# Altium project _X-Link-v9.x.PrjPCB
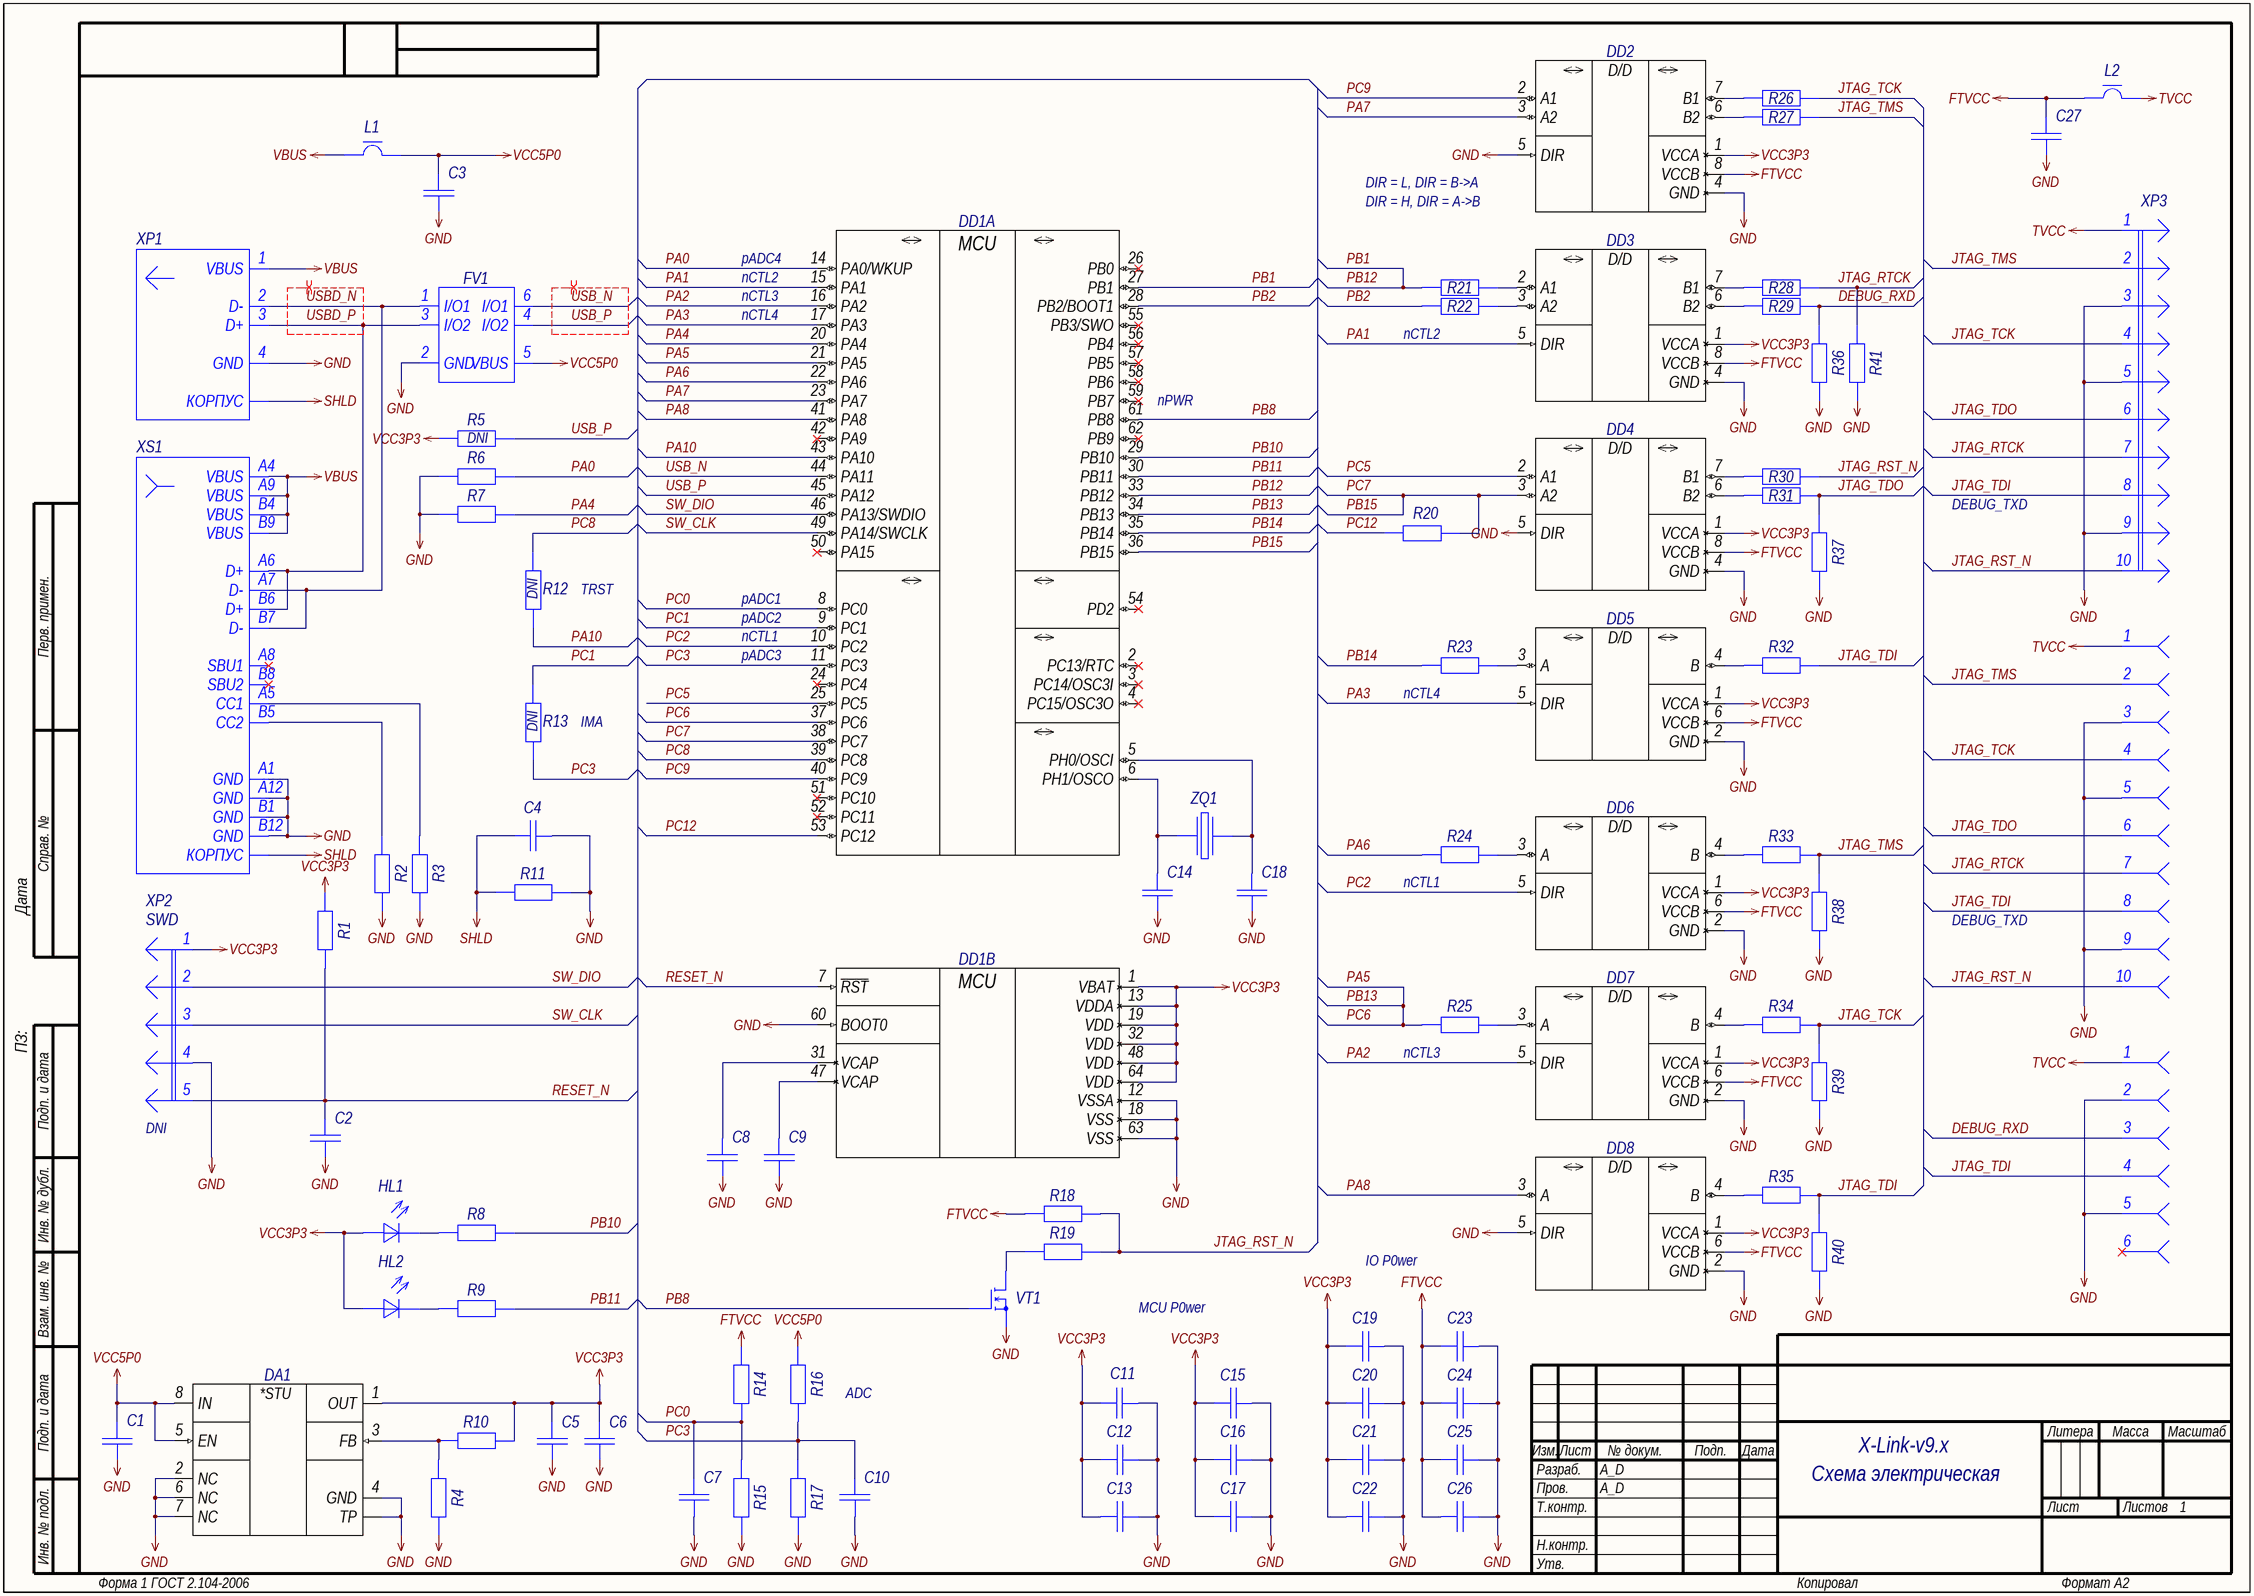
[diagram p0: 01_MAIN.SchDoc]
GlobalOrganizationName: A_D Electronics; GlobalProjectName: X-Link-v9.x; GlobalProjectNumber: A_D.000000.001; GlobalProjectRevision: 0; PCB_Week: 2012
1 sheet, 90 parts. Net scope: hierarchical (ports join the sheet entries above them; power ports are global).
Board file: BOARD.PcbDoc

## Sheet 01_MAIN.SchDoc: =GlobalProjectName
size 594 x 420 mm; CheckedBy: A_D; Author: A_D; Organization: A_D Electronics; DocumentNumber: A_D.000000.001 Э3; Revision: 0; SheetTotal: 1; PageSetup: Record=PageOptions|CenterHorizontal=True|CenterVertical=True|PrintScale=0.70|XCorrection=1.00|YCorrection=1.00|PrintKind=2|BorderSize=5000000|LeftOffset=9000|BottomOffset=10100|Orientation=2|PaperLength=11176|PaperWidth=8636|Scale=100|PaperSource=259|PrintQuality=-3|MediaType=1|DitherType=10|PrintScaleMode=1|PaperKind=A3|PaperIndex=8; FirstApplication: A_D.000000.001; DocumentName: X-Link-v9.x

### Parts
C1  Capacitor  [C0402_L]  (value not drawn)
C2  (no value)  [C0402_L]
C3  Capacitor  [C0603_L]  (value not drawn)
C4  (no value)  [C0402_L]
C5  Capacitor  [C0402_L]  (value not drawn)
C6  Capacitor  [C0402_L]  (value not drawn)
C7  Capacitor  [C0402_L]  (value not drawn)
C8  Capacitor  [C0402_L]  (value not drawn)
C9  Capacitor  [C0402_L]  (value not drawn)
C10  Capacitor  [C0402_L]  (value not drawn)
C11  Capacitor  [C0402_L]  (value not drawn)
C12  (no value)  [C0402_L]
C13  (no value)  [C0402_L]
C14  Capacitor  [C0402_L]  (value not drawn)
C15  (no value)  [C0402_L]
C16  (no value)  [C0402_L]
C17  (no value)  [C0402_L]
C18  Capacitor  [C0402_L]  (value not drawn)
C19  (no value)  [C0402_L]
C20  (no value)  [C0402_L]
C21  (no value)  [C0402_L]
C22  (no value)  [C0402_L]
C23  (no value)  [C0402_L]
C24  (no value)  [C0402_L]
C25  (no value)  [C0402_L]
C26  (no value)  [C0402_L]
C27  Capacitor  [C0402_L]  (value not drawn)
DA1  TPS73701DRB  [VSON-8_065P300X300X100_N]  (value not drawn)
DD1  STM32F205RxTx-Series  [LQFP-64_050P1000X1000X160_N]  (value not drawn)  (parts A,B of 2)
DD2  SN74LVC2T45DCx-Series  [VSSOP-8_050P200X230X090_N]  (value not drawn)
DD3  SN74LVC2T45DCx-Series  [VSSOP-8_050P200X230X090_N]  (value not drawn)
DD4  SN74LVC2T45DCx-Series  [VSSOP-8_050P200X230X090_N]  (value not drawn)
DD5  74LVC1T45x-Series  [X2-DFN-6_050P140X100X040_N]  (value not drawn)
DD6  74LVC1T45x-Series  [X2-DFN-6_050P140X100X040_N]  (value not drawn)
DD7  74LVC1T45x-Series  [X2-DFN-6_050P140X100X040_N]  (value not drawn)
DD8  74LVC1T45x-Series  [X2-DFN-6_050P140X100X040_N]  (value not drawn)
FV1  USBLC6-2x6  [SOT-666_050P160X120X060_N]  (value not drawn)
HL1  Text  [LD0402]  (value not drawn)
HL2  Text  [LD0402]  (value not drawn)
L1  FerriteBead  [L0402_L]  (value not drawn)
L2  FerriteBead  [L0402_L]  (value not drawn)
R1  Resistor  [R0402_L]  (value not drawn)
R2  Resistor  [R0402_L]  (value not drawn)
R3  Resistor  [R0402_L]  (value not drawn)
R4  Resistor  [R0402_L]  (value not drawn)
R5  Resistor  [R0402_L]  (value not drawn)  (no BOM)
R6  Resistor  [R0402_L]  (value not drawn)
R7  Resistor  [R0402_L]  (value not drawn)
R8  Resistor  [R0402_L]  (value not drawn)
R9  Resistor  [R0402_L]  (value not drawn)
R10  Resistor  [R0402_L]  (value not drawn)
R11  (no value)  [R0402_L]
R12  Resistor  [R0402_L]  (value not drawn)  (no BOM)
R13  Resistor  [R0402_L]  (value not drawn)  (no BOM)
R14  Resistor  [R0402_L]  (value not drawn)
R15  Resistor  [R0402_L]  (value not drawn)
R16  Resistor  [R0402_L]  (value not drawn)
R17  Resistor  [R0402_L]  (value not drawn)
R18  Resistor  [R0402_L]  (value not drawn)
R19  Resistor  [R0402_L]  (value not drawn)
R20  Resistor  [R0402_L]  (value not drawn)
R21  Resistor  [R0402_L]  (value not drawn)
R22  Resistor  [R0402_L]  (value not drawn)
R23  Resistor  [R0402_L]  (value not drawn)
R24  Resistor  [R0402_L]  (value not drawn)
R25  Resistor  [R0402_L]  (value not drawn)
R26  Resistor  [R0402_L]  (value not drawn)
R27  Resistor  [R0402_L]  (value not drawn)
R28  Resistor  [R0402_L]  (value not drawn)
R29  Resistor  [R0402_L]  (value not drawn)
R30  Resistor  [R0402_L]  (value not drawn)
R31  Resistor  [R0402_L]  (value not drawn)
R32  Resistor  [R0402_L]  (value not drawn)
R33  Resistor  [R0402_L]  (value not drawn)
R34  Resistor  [R0402_L]  (value not drawn)
R35  Resistor  [R0402_L]  (value not drawn)
R36  Resistor  [R0402_L]  (value not drawn)
R37  Resistor  [R0402_L]  (value not drawn)
R38  Resistor  [R0402_L]  (value not drawn)
R39  Resistor  [R0402_L]  (value not drawn)
R40  Resistor  [R0402_L]  (value not drawn)
R41  Resistor  [R0402_L]  (value not drawn)
VT1  MOSFET-N  [SOT-883B_035P060X100X040_N]  (value not drawn)
XP1  Text  [DS1097]  (value not drawn)
XP2  SWD  [PLS-5]  (no BOM)
XP3  JTAG  [IDC-10MR]  (value not drawn)
XS1  Text  [U262-161N-4BVC11]  (value not drawn)
XS2  JTAG-FFC  [XF2M-1015-1A]  (value not drawn)  (parts A,B,C,D,E,F,G,H,I,J of 10)
XS3  SWO  [XF2M-0615-1A]  (value not drawn)  (parts A,B,C,D,E,F of 6)
ZQ1  Crystal  [SMD 5x3.2mm]  (value not drawn)

### Nets
FTVCC: C23.1 C24.1 C25.1 C26.1 C27.2 DD2.8(VCCB) DD3.8(VCCB) DD4.8(VCCB) DD5.6(VCCB) DD6.6(VCCB) DD7.6(VCCB) DD8.6(VCCB) L2.1 R14.2 R18.1
GND: C1.1 C2.2 C3.1 C4.1 C5.1 C6.1 C7.2 C8.1 C9.1 C10.2 C11.1 C12.2 C13.2 C14.1 C15.2 C16.2 C17.2 C18.1 C19.2 C20.2 C21.2 C22.2 C23.2 C24.2 C25.2 C26.2 C27.1 DA1.2(NC) DA1.4(GND) DA1.6(NC) DA1.7(NC) DA1.TP DD1.12(VSSA) DD1.18(VSS) DD1.60(BOOT0) DD1.63(VSS) DD2.4(GND) DD2.5(DIR) DD3.4(GND) DD4.4(GND) DD4.5(DIR) DD5.2(GND) DD6.2(GND) DD7.2(GND) DD8.2(GND) DD8.5(DIR) FV1.2(GND) R2.1 R3.1 R4.1 R6.1 R7.1 R11.2 R15.1 R17.1 R36.1 R37.1 R38.1 R39.1 R40.1 R41.1 VT1.3(S) XP1.4(GND) XP2.4 XP3.3 XP3.5 XP3.9 XS1.A1(GND) XS1.A12(GND) XS1.B1(GND) XS1.B12(GND) XS2.3 XS2.5 XS2.9 XS3.2 XS3.5
SHLD: C4.2 R11.1 XP1.SH(КОРПУС) XS1.SH(КОРПУС)
TVCC: L2.2 XP3.1 XS2.1 XS3.1
VBUS: L1.1 XP1.1(VBUS) XS1.A4(VBUS) XS1.A9(VBUS) XS1.B4(VBUS) XS1.B9(VBUS)
VCC3P3: C5.2 C6.2 C11.2 C12.1 C13.1 C15.1 C16.1 C17.1 C19.1 C20.1 C21.1 C22.1 DA1.1(OUT) DD1.1(VBAT) DD1.13(VDDA) DD1.19(VDD) DD1.32(VDD) DD1.48(VDD) DD1.64(VDD) DD2.1(VCCA) DD3.1(VCCA) DD4.1(VCCA) DD5.1(VCCA) DD6.1(VCCA) DD7.1(VCCA) DD8.1(VCCA) HL1.1(А) HL2.1(А) R1.2 R5.1 R10.2 XP2.1
VCC5P0: C1.2 C3.2 DA1.5(EN) DA1.8(IN) FV1.5(VBUS) L1.2 R16.2
DEBUG_RXD: R29.2 R36.2 XS3.3
JTAG_RST_N: R18.2 R19.2 R30.2 XP3.10 XS2.10
JTAG_RTCK: R28.2 R41.2 XP3.7 XS2.7
JTAG_TCK: R26.2 R34.2 R39.2 XP3.4 XS2.4
JTAG_TDI: R32.2 R35.2 R40.2 XP3.8 XS2.8 XS3.4
JTAG_TDO: R31.2 R37.2 XP3.6 XS2.6
JTAG_TMS: R27.2 R33.2 R38.2 XP3.2 XS2.2
PA0: DD1.14(PA0/WKUP) R6.2
PA1: DD1.15(PA1) DD3.5(DIR)
PA2: DD1.16(PA2) DD7.5(DIR)
PA3: DD1.17(PA3) DD5.5(DIR)
PA4: DD1.20(PA4) R7.2
PA5: DD1.21(PA5) DD1.34(PB13) DD1.37(PC6) R25.1  [also labelled PB13, PC6]
PA6: DD1.22(PA6) R24.1
PA7: DD1.23(PA7) DD2.3(A2)
PA8: DD1.41(PA8) DD8.3(A)
PA10: DD1.43(PA10) R12.1
PB1: DD1.27(PB1) DD1.33(PB12) R21.1  [also labelled PB12]
PB2: DD1.28(PB2/BOOT1) R22.1
PB8: DD1.61(PB8) VT1.1(G)
PB10: DD1.29(PB10) R8.2
PB11: DD1.30(PB11) R9.2
PB14: DD1.35(PB14) R23.1
PB15: DD1.36(PB15) DD1.38(PC7) DD4.3(A2) R20.2  [also labelled PC7]
PC0: C7.1 DD1.8(PC0) R14.1 R15.2
PC1: DD1.9(PC1) R13.2
PC2: DD1.10(PC2) DD6.5(DIR)
PC3: C10.1 DD1.11(PC3) R13.1 R16.1 R17.2
PC5: DD1.25(PC5) DD4.2(A1)
PC8: DD1.39(PC8) R12.2
PC9: DD1.40(PC9) DD2.2(A1)
PC12: DD1.53(PC12) R20.1
RESET_N: C2.1 DD1.7(~{RST}) R1.1 XP2.5
SW_CLK: DD1.49(PA14/SWCLK) XP2.3
SW_DIO: DD1.46(PA13/SWDIO) XP2.2
USB_N: DD1.44(PA11) FV1.6(I/O1)
USB_P: DD1.45(PA12) FV1.4(I/O2) R5.2
USBD_N: FV1.1(I/O1) XP1.2(D-) XS1.A7(D-) XS1.B7(D-)
USBD_P: FV1.3(I/O2) XP1.3(D+) XS1.A6(D+) XS1.B6(D+)
NetC8_2: C8.2 DD1.31(VCAP)
NetC9_2: C9.2 DD1.47(VCAP)
NetC14_2: C14.2 DD1.6(PH1/OSCO) ZQ1.1
NetC18_2: C18.2 DD1.5(PH0/OSCI) ZQ1.3
NetDA1_3: DA1.3(FB) R4.2 R10.1
NetDD2_6: DD2.6(B2) R27.1
NetDD2_7: DD2.7(B1) R26.1
NetDD3_2: DD3.2(A1) R21.2
NetDD3_3: DD3.3(A2) R22.2
NetDD3_6: DD3.6(B2) R29.1
NetDD3_7: DD3.7(B1) R28.1
NetDD4_6: DD4.6(B2) R31.1
NetDD4_7: DD4.7(B1) R30.1
NetDD5_3: DD5.3(A) R23.2
NetDD5_4: DD5.4(B) R32.1
NetDD6_3: DD6.3(A) R24.2
NetDD6_4: DD6.4(B) R33.1
NetDD7_3: DD7.3(A) R25.2
NetDD7_4: DD7.4(B) R34.1
NetDD8_4: DD8.4(B) R35.1
NetHL1_2: HL1.2(К) R8.1
NetHL2_2: HL2.2(К) R9.1
NetR2_2: R2.2 XS1.B5(CC2)
NetR3_2: R3.2 XS1.A5(CC1)
NetR19_1: R19.1 VT1.2(D)

Not connected (* = marked no-connect by the designer): DD1 2(PC13/RTC)* 3(PC14/OSC3I)* 4(PC15/OSC3O)* 24(PC4)* 26(PB0)* 42(PA9)* 50(PA15)* 51(PC10)* 52(PC11)* 54(PD2)* 55(PB3/SWO)* 56(PB4)* 57(PB5)* 58(PB6)* 59(PB7)* 62(PB9)*; XS1 A8(SBU1)* B8(SBU2)*; XS3 6*

### Layout directives
differential pair; differential pair class USBD: USBD_N, USBD_P
differential pair; differential pair class USB: USB_N, USB_P

### Notes on the sheet
- (near DD2) DIR = L, DIR = B->A
- (near DD2) DIR = H, DIR = A->B
- pADC4
- nCTL3
- nCTL2
- nCTL4
- (near R22) nCTL2
- (near DD1) nPWR
- (near R5) DNI
- DEBUG_TXD
- (near R12) DNI
- TRST
- nCTL1
- pADC1
- pADC2
- pADC3
- (near R23) nCTL4
- (near R13) DNI
- IMA
- (near R24) nCTL1
- (near R25) nCTL3
- (near XP2) DNI
- IO P0wer
- MCU P0wer
- ADC
- Схема электрическая
  принципиальная
- Перв. примен.
- Справ. №
- ПЗ:                             Дата
- Подп. и дата
- Инв. № дубл.
- Взам. инв. №
- Разраб.
- Изм.
- Лист
- № докум.
- Подп.
- Дата
- Литера
- Масса
- Масштаб
- Пров.
- Т.контр.
- Листов
- Инв. № подл.
- Н.контр.
- Утв.
- Форма 1 ГОСТ 2.104-2006
- Копировал
- Формат А2
- (in symbol 74LVC1T45FZ4-7) D/D
- (in symbol SN74LVC2T45DCUR) D/D
- (in symbol STM32F205RET6, part A) MCU
- (in symbol STM32F205RET6, part B) MCU
- (in symbol TPS73701DRBR) *STU

### Library data of the parts
C1 = GRM155R61C105KA12D: Manufacturer: Murata; Type: Конденсатор; ID: 272; Value: 1uF; Voltage: 16V; Tolerance: ±10%; Dielectric Type: X5R; Application Category: 1; Working Temperature Min: -55°С; Working Temperature Max: +85°С; Published: 18.05.2010; Publisher: Andrew Danich; Part Number: GRM155R61C105KA12D; Footprint: 0402; ClassName: DirectConnect
C2 C4 C12 C13 C15-C17 C19-C26 = GCM155R71C104KA55D: Manufacturer: Murata; Type: Конденсатор; ID: 163; Value: 0.1uF; Voltage: 16V; Tolerance: ±10%; Dielectric Type: X7R; Application Category: 1; Working Temperature Min: -55°С; Working Temperature Max: +125°С; Functional Analog: GRM155R71C104KA88D; Published: 18.05.2010; Publisher: Andrew Danich; Part Number: GCM155R71C104KA55D; Footprint: 0402
  C4 C12 C13 C15-C17 C19-C26: ClassName: DirectConnect
C3 = GRM188R61A106KE69D: Manufacturer: Murata; Type: Конденсатор; ID: 173; Value: 10uF; Voltage: 10V; Tolerance: ±10%; Dielectric Type: X5R; Application Category: 1; Working Temperature Min: -55°С; Working Temperature Max: +85°С; Published: 18.05.2010; Publisher: Andrew Danich; Part Number: GRM188R61A106KE69D; Footprint: 0603; ClassName: DirectConnect
C5 C6 C11 = GRM155R60J475ME87D: Manufacturer: Murata; Type: Конденсатор; ID: 223; Value: 4.7uF; Voltage: 6.3V; Tolerance: ±20%; Dielectric Type: X5R; Application Category: 1; Working Temperature Min: -55°С; Working Temperature Max: +85°С; Published: 18.05.2010; Publisher: Andrew Danich; Part Number: GRM155R60J475ME87D; Footprint: 0402; ClassName: DirectConnect
C7 C10 = GCM155R71E103KA37D: Manufacturer: Murata; Type: Конденсатор; ID: 150; Value: 0.01uF; Voltage: 25V; Tolerance: ±10%; Dielectric Type: X7R; Application Category: 1; Working Temperature Min: -55°С; Working Temperature Max: +125°С; Functional Analog: GRM155R71E103KA01D; Published: 18.05.2010; Publisher: Andrew Danich; Part Number: GCM155R71E103KA37D; Footprint: 0402
C8 C9 C27 = GRM155D71C225ME11D: Manufacturer: Murata; Type: Конденсатор; ID: 180; Value: 2.2uF; Voltage: 16V; Tolerance: ±20%; Dielectric Type: X7T; Application Category: 1; Working Temperature Min: -55°С; Working Temperature Max: +125°С; Functional Analog: GRM155R60J225ME15D; Published: 18.05.2010; Publisher: Andrew Danich; Part Number: GRM155D71C225ME11D; Footprint: 0402; ClassName: DirectConnect
C14 C18 = GRM1555C1H120JA01D: Manufacturer: Murata; Type: Конденсатор; ID: 159; Value: 12pF; Voltage: 50V; Tolerance: ±5%; Dielectric Type: NP0; Application Category: 1; Published: 18.05.2010; Publisher: Andrew Danich; Part Number: GRM1555C1H120JA01D; Footprint: 0402; ClassName: DirectConnect
DA1 = TPS73701DRBR: Manufacturer: Texas Instruments; ID: 26; Input Voltage: +2.2…5.5V; Output Current: 1A; Output Voltage: +1.2…5.5V; Application Category: 1; Working Temperature Min: -40°С; Working Temperature Max: +125°С; Functional Analog: TPS73701DRBT; Published: 25.03.2019; Publisher: Andrew Danich; Type: Микросхема; Part Number: TPS73701DRBR; Value: TPS73701DRBR; ClassName: DirectConnect
DD1 = STM32F205RET6: Manufacturer: STMicroelectronics; ID: 33; Supply Operation: +1.8…3.6V; Flash: 512K; SRAM: 128K; Prog Interface: JTAG, SWD, UART; I/O Lines: 51; Operation Frequency: 120MHz; Application Category: 1; Working Temperature Min: -40°С; Working Temperature Max: +85°С; Published: 16.10.2015; Publisher: Andrew Danich; Type: Микросхема; Part Number: STM32F205RET6; Value: STM32F205RET6; EEPROM: -
DD2-DD4 = SN74LVC2T45DCUR: Manufacturer: Texas Instruments; ID: 18; Supply 1 Operation: +1,65…5,5V; Supply Current: 10uA; Directional: Unidirection; Channels: 2; Max Data Rate: 420Mbps; Application Category: 1; Working Temperature Min: -40°С; Working Temperature Max: +85°С; Functional Analog: 74LVCH2T45DC,125; Published: 06.03.2020; Publisher: Andrew Danich; Type: Микросхема; Part Number: SN74LVC2T45DCUR; Value: SN74LVC2T45DCUR; Supply 2 Operation: +1,65…5,5V
DD5-DD8 = 74LVC1T45FZ4-7: Manufacturer: Diodes Incorporated; ID: 13; Supply 1 Operation: +1.65…5.5V; Supply Current: 3uA; Directional: Bidirection; Channels: 1; Prop Delay: 15.1nS; Working Temperature Min: -40°С; Working Temperature Max: +150°С; Published: 17.07.2019; Publisher: Andrew Danich; Type: Микросхема; Part Number: 74LVC1T45FZ4-7; Value: 74LVC1T45FZ4-7; Supply 2 Operation: +1.65…5.5V; Application Category: 1
FV1 = USBLC6-2P6: Manufacturer: STMicroelectronics; ID: 30; Breakdown Voltage: 6V; Reverse Stand Off Voltage: 17V; Forward Voltage: 0.95V; Peak Forward Current: 5A; Junction Capacitance: 2.5pF; Directional: Bidirectional; Application Category: 1; Working Temperature Min: -40°С; Working Temperature Max: +125°С; Published: 21.02.2017; Publisher: Andrew Danich; Type: Супрессор; Part Number: USBLC6-2P6; Value: USBLC6-2P6; Functional Analog: -; ClassName: DirectConnect
HL1 HL2 = KPHHS-1005QBC-D-V: Manufacturer: Kingbright; Type: Индикатор единичный; ID: 24; Forward Voltage: 3.3V; Forward Current: 20mA; Power Dissipation: 120mW; Luminous Flux: 60; Color: Blue; Leds: 1; Working Temperature Min: -40°С; Working Temperature Max: +85°С; Published: 03.12.2013; Publisher: Andrew Danich; Part Number: KPHHS-1005QBC-D-V; Value: KPHHS-1005QBC-D-V; Footprint: 0402; Application Category: 1
L1 L2 = BLM15PD121SN1D: Manufacturer: Murata; Type: Дроссель; ID: 11; Rated Current: 1.3A; Impedance at 100Mhz: 120ohm; Tolerance: ±25%; DC Resistance: 0.09ohm; Inductor Type: EMIFIL; Application Category: 1; Working Temperature Min: -55°С; Working Temperature Max: +125°С; Published: 14.11.2014; Publisher: Andrew Danich; Part Number: BLM15PD121SN1D; Value: BLM15PD121SN1D; Footprint: 0402; ClassName: DirectConnect
R1 = RC0402JR-0710KL: Manufacturer: Yageo; ID: 476; Value: 10k; Limit Voltage: 50V; Tolerance: ±5%; Temperature Coefficient: 100ppm; Total Power Dissipation: 0.1W; Series Type: Thick-Film; Application Category: 1; Working Temperature Min: -55°С; Working Temperature Max: +155°С; Published: 24.03.2010; Publisher: Andrew Danich; Type: Резистор; Part Number: RC0402JR-0710KL; Footprint: 0402
R2 R3 = RC0402FR-075K1L: Manufacturer: Yageo; ID: 496; Value: 5.1k; Limit Voltage: 50V; Tolerance: ±1%; Temperature Coefficient: 100ppm; Total Power Dissipation: 0.1W; Series Type: Thick-Film; Application Category: 1; Working Temperature Min: -55°С; Working Temperature Max: +155°С; Published: 24.03.2010; Publisher: Andrew Danich; Type: Резистор; Part Number: RC0402FR-075K1L; Footprint: 0402
R4 = RC0402FR-0712KL: Manufacturer: Yageo; ID: 318; Value: 12k; Limit Voltage: 50V; Tolerance: ±1%; Temperature Coefficient: 100ppm; Total Power Dissipation: 0.1W; Series Type: Thick-Film; Application Category: 1; Working Temperature Min: -55°С; Working Temperature Max: +155°С; Published: 24.03.2010; Publisher: Andrew Danich; Type: Резистор; Part Number: RC0402FR-0712KL; Footprint: 0402
R5 = RC0402FR-071K6L: Manufacturer: Yageo; ID: 504; Value: 1.6k; Limit Voltage: 50V; Tolerance: ±1%; Temperature Coefficient: 100ppm; Total Power Dissipation: 0.1W; Series Type: Thick-Film; Application Category: 1; Working Temperature Min: -55°С; Working Temperature Max: +155°С; Published: 24.03.2010; Publisher: Andrew Danich; Type: Резистор; Part Number: RC0402FR-071K6L; Footprint: 0402
R6 R7 R12 R13 R20 = RC0402JR-070RL: Manufacturer: Yageo; ID: 362; Value: 0; Limit Voltage: 50V; Tolerance: ±5%; Temperature Coefficient: 100ppm; Total Power Dissipation: 0.1W; Series Type: Thick-Film; Application Category: 1; Working Temperature Min: -55°С; Working Temperature Max: +155°С; Published: 24.03.2010; Publisher: Andrew Danich; Type: Резистор; Part Number: RC0402JR-070RL; Footprint: 0402
R8 R9 = RC0402JR-071KL: Manufacturer: Yageo; ID: 3; Value: 1k; Limit Voltage: 50V; Tolerance: ±5%; Temperature Coefficient: 100ppm; Total Power Dissipation: 0.1W; Series Type: Thick-Film; Application Category: 1; Working Temperature Min: -55°С; Working Temperature Max: +155°С; Published: 24.03.2010; Publisher: Andrew Danich; Type: Резистор; Part Number: RC0402JR-071KL; Footprint: 0402
R10 = RC0402FR-0722K1L: Manufacturer: Yageo; ID: 447; Value: 22.1k; Limit Voltage: 50V; Tolerance: ±1%; Temperature Coefficient: 100ppm; Total Power Dissipation: 0.1W; Series Type: Thick-Film; Application Category: 1; Working Temperature Min: -55°С; Working Temperature Max: +155°С; Published: 24.03.2010; Publisher: Andrew Danich; Type: Резистор; Part Number: RC0402FR-0722K1L; Footprint: 0402
R11 = RC0402JR-07100KL: Manufacturer: Yageo; ID: 351; Value: 100k; Limit Voltage: 50V; Tolerance: ±5%; Temperature Coefficient: 100ppm; Total Power Dissipation: 0.1W; Series Type: Thick-Film; Application Category: 1; Working Temperature Min: -55°С; Working Temperature Max: +155°С; Published: 24.03.2010; Publisher: Andrew Danich; Type: Резистор; Part Number: RC0402JR-07100KL; Footprint: 0402; ClassName: DirectConnect
R14-R17 = RC0402FR-0710KL: Manufacturer: Yageo; ID: 2; Value: 10k; Limit Voltage: 50V; Tolerance: ±1%; Temperature Coefficient: 100ppm; Total Power Dissipation: 0.1W; Series Type: Thick-Film; Application Category: 1; Working Temperature Min: -55°С; Working Temperature Max: +155°С; Published: 24.03.2010; Publisher: Andrew Danich; Type: Резистор; Part Number: RC0402FR-0710KL; Footprint: 0402
R18 = RC0402JR-074K7L: Manufacturer: Yageo; ID: 4; Value: 4.7k; Limit Voltage: 50V; Tolerance: ±5%; Temperature Coefficient: 100ppm; Total Power Dissipation: 0.1W; Series Type: Thick-Film; Application Category: 1; Working Temperature Min: -55°С; Working Temperature Max: +155°С; Published: 24.03.2010; Publisher: Andrew Danich; Type: Резистор; Part Number: RC0402JR-074K7L; Footprint: 0402
R19 = RC0402JR-0751RL: Manufacturer: Yageo; ID: 374; Value: 51; Limit Voltage: 50V; Tolerance: ±5%; Temperature Coefficient: 100ppm; Total Power Dissipation: 0.1W; Series Type: Thick-Film; Application Category: 1; Working Temperature Min: -55°С; Working Temperature Max: +155°С; Published: 24.03.2010; Publisher: Andrew Danich; Type: Резистор; Part Number: RC0402JR-0751RL; Footprint: 0402
R21-R27 R30 R31 R35 = RC0402JR-07430RL: Manufacturer: Yageo; ID: 376; Value: 430; Limit Voltage: 50V; Tolerance: ±5%; Temperature Coefficient: 100ppm; Total Power Dissipation: 0.1W; Series Type: Thick-Film; Application Category: 1; Working Temperature Min: -55°С; Working Temperature Max: +155°С; Published: 24.03.2010; Publisher: Andrew Danich; Type: Резистор; Part Number: RC0402JR-07430RL; Footprint: 0402
R28 R29 R32-R34 = RC0402JR-07100RL: Manufacturer: Yageo; ID: 479; Value: 100; Limit Voltage: 50V; Tolerance: ±5%; Temperature Coefficient: 100ppm; Total Power Dissipation: 0.1W; Series Type: Thick-Film; Application Category: 1; Working Temperature Min: -55°С; Working Temperature Max: +155°С; Published: 24.03.2010; Publisher: Andrew Danich; Type: Резистор; Part Number: RC0402JR-07100RL; Footprint: 0402
R36-R41 = RC0402JR-07200KL: Manufacturer: Yageo; ID: 353; Value: 200k; Limit Voltage: 50V; Tolerance: ±5%; Temperature Coefficient: 100ppm; Total Power Dissipation: 0.1W; Series Type: Thick-Film; Application Category: 1; Working Temperature Min: -55°С; Working Temperature Max: +155°С; Published: 24.03.2010; Publisher: Andrew Danich; Type: Резистор; Part Number: RC0402JR-07200KL; Footprint: 0402
VT1 = NX3008NBKMB: Manufacturer: NXP Semiconductors; Type: Транзистор; ID: 36; D-S Voltage: 30V; Drain Current: 530mA; D-S On-Resistance: 1.4omh; Gate Capacitance: 50pF; Total Power Dissipation: 360mW; Gate Threshold Voltage: 1.1V; Application Category: 1; Working Temperature Min: -55°С; Working Temperature Max: +150°С; Published: 24.09.2010; Publisher: Andrew Danich; Part Number: NX3008NBKMB; Value: NX3008NBKMB; Functional Analog: -
XP1 = DS1097-B: Manufacturer: Connfly Electronic Co., Ltd; ID: 3; Limit Voltage: 30V; Limit Current: 1.5A; Connector Type: Male; Interface: USB 2.0; Max Data Rate: 480 mbps; Application Category: 1; Functional Analog: USB-AR, DS1097-W; Published: 13.08.2015; Publisher: Andrew Danich; Type: Вилка; Part Number: DS1097-B; Value: DS1097-B; Pins: 6; Mount Type: Through hole; ClassName: DirectConnect
XP2 = PLS-5: Value: PLS-5; ID: 4; Limit Voltage: 250V; Limit Current: 3A; Connector Type: Male; Resistance: 15momh; Surface Finish: Gold; Pitch: 2.54mm; Application Category: 1; Published: 07.03.2013; Publisher: Andrew Danich; Type: Вилка; Part Number: PLS-5; Pins: 5
XP3 = IDC-10MR: ID: 11; Limit Voltage: 500V; Limit Current: 1A; Connector Type: Male; Resistance: 20mohm; Pitch: 2.54mm; Application Category: 1; Functional Analog: DS1013-10RSIB, C3510-10SPGB00; Value: IDC-10MR; Published: 07.03.2013; Publisher: Andrew Danich; Type: Вилка; Part Number: IDC-10MR; Pins: 10
XS1 = U262-161N-4BVC11: Manufacturer: XKB Enterprise; ID: 41; Limit Voltage: 30V; Limit Current: 3A; Connector Type: Female; Interface: USB 3.1 Type C; Max Data Rate: 480 mbps; Application Category: 1; Working Temperature Min: -40°С; Working Temperature Max: +85°С; Functional Analog: C167321; Published: 17.09.2018; Publisher: Andrew Danich; Type: Розетка; Part Number: U262-161N-4BVC11; Value: U262-161N-4BVC11; Pins: 16; Mount Type: Surface; ClassName: DirectConnect
XS2 = XF2M-1015-1A: Manufacturer: Omron Electronics; ID: 7; Limit Voltage: 50V; Limit Current: 500mA; Connector Type: Female; Resistance: 0.05ohm; Pitch: 0.5mm; Application Category: 1; Working Temperature Min: -30°С; Working Temperature Max: +85°С; Published: 07.09.2015; Publisher: Viktor Klishin; Type: Розетка; Part Number: XF2M-1015-1A; Value: XF2M-1015-1A; Pins: 10; Series: FPC
XS3 = XF2M-0615-1A: Manufacturer: Omron Electronics; ID: 6; Limit Voltage: 50V; Limit Current: 500mA; Connector Type: Female; Resistance: 0.05ohm; Pitch: 0.5mm; Application Category: 1; Working Temperature Min: -30°С; Working Temperature Max: +85°С; Published: 16.02.2017; Publisher: Viktor Klishin; Type: Розетка; Part Number: XF2M-0615-1A; Value: XF2M-0615-1A; Pins: 6; Series: FPC
ZQ1 = AB-12.000MALE-T: ID: 14; Output Frequency: 12MHz; Load Capacitance: 12pF; Application Category: 1; Published: 08.03.2013; Publisher: Andrew Danich; Type: Резонатор; Part Number: AB-12.000MALE-T; Value: AB-12.000MALE-T

## Assembly variants
Type-C: not fitted XP1
Type-A: not fitted R2 R3 XS1